# Altium schematic sheet Matherboard.SchDoc
size A4
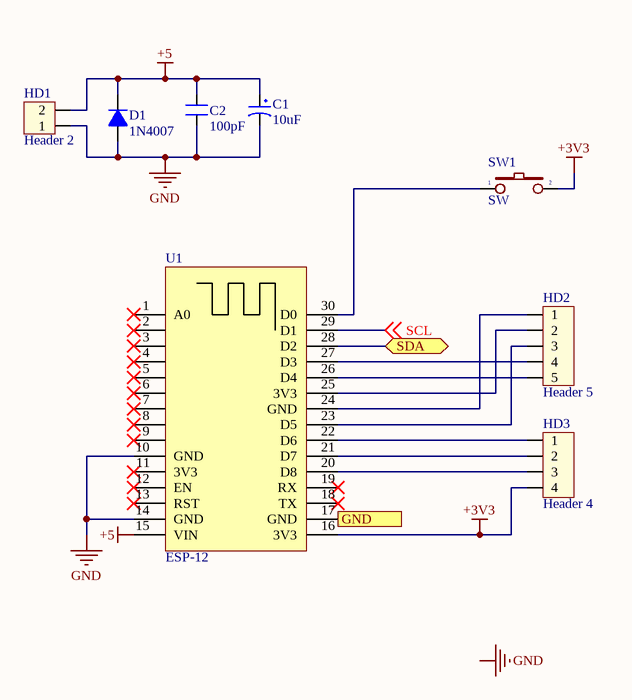
[diagram p0: Matherboard.SchDoc]

## Parts
C1  10uF  [CP1/2]
C2  100pF  [CN1]
D1  1N4007  [SMA]
HD1  Header 2  [HED2]
HD2  Header 5  [HED5 - KF270 - duplicate]
HD3  Header 4  [HED4]
SW1  SW  [SW2]
U1  ESP-12  [Node MCU]

## Ports
GND, SDA (bidir)

## Nets
+3V3: HD3.4 SW1.2 U1.16(3V3)
+5: C1.1 C2.2 D1.2(K) HD1.2 U1.15(VIN)
GND: C1.2 C2.1 D1.1(A) HD1.1 U1.10(GND) U1.14(GND)
GND: U1.17(GND) ; port GND  [a separate net that carries the same name]
SCL: U1.29(D1) ; off-sheet SCL
SDA: U1.28(D2) ; port SDA
NetHD2_1: HD2.1 U1.24(GND)
NetHD2_2: HD2.2 U1.25(3V3)
NetHD2_3: HD2.3 U1.23(D5)
NetHD2_4: HD2.4 U1.27(D3)
NetHD2_5: HD2.5 U1.26(D4)
NetHD3_1: HD3.1 U1.22(D6)
NetHD3_2: HD3.2 U1.21(D7)
NetHD3_3: HD3.3 U1.20(D8)
NetSW1_1: SW1.1 U1.30(D0)

Not connected (* = marked no-connect by the designer): U1 1(A0)* 2* 3* 4* 5* 6* 7* 8* 9* 11(3V3)* 12(EN)* 13(RST)* 18(TX)* 19(RX)*

## Notes on the sheet
- Labels drawn without touching a wire or pin: GND

## Library data of the parts
C1 = CP1: Cap P  0,1uF < 22uF , 16 - 50V; Value: 10uF/50V; Description 1: 10 => 220uF/6,3V/10V - 10uF => 100uF/16V; Description 2: 0,1uF => 33uF/50V - 10uF => 22uF/63V; Description 3: 0,47uF => 10uF/100V
C2 = CN1: Cap np  1pF - 472pF; Value: 100pF
D1 = diode: Diode 1A; Value: 1N4007
HD1 = Hed2: Header 2 (Green); Value: Header 2
HD2 = Hed5: Header 5 (Green); Value: Header 4
HD3 = Hed4: Header 4 (Green); Value: Header 4
SW1 = SW2: Switch button 2 pin; Value: SW chip 2 pin
U1 = NodeMCU